# EAGLE design LedDriver (EAGLE 7.5.0)
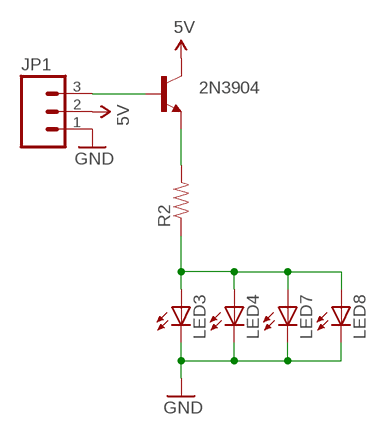
[diagram p0: schematic, sheet 1]

## Parts
2N3904  TRANSISTOR_NPNTO-92-AMMO  [TO-92-AMMO]
JP1  M03PTH  [1X03]
LED3  LED5MM  [LED5MM]
LED4  LED5MM  [LED5MM]
LED7  LED5MM  [LED5MM]
LED8  LED5MM  [LED5MM]
R2  RESISTORAXIAL-0.3  [AXIAL-0.3]

## Nets
5V: 2N3904.3(C) JP1.2
GND: JP1.1 LED3.K(C) LED4.K(C) LED7.K(C) LED8.K(C)
N$3: LED3.A LED4.A LED7.A LED8.A R2.P$1
N$7: 2N3904.1(E) R2.P$2
N$9: 2N3904.2(B) JP1.3

## Library data of the parts
2N3904 = barbary_enterprises:TRANSISTOR_NPN: Generic NPN BJT MMBT2222A - TRANS-08049 (SOT-23, 1A 40V) MPSA42 - TRANS-09116 (SOT-23, 500mA 300V) MMBT5088LT1G - TRANS-11160 (SOT-23, 50 mA 30V)
JP1 = SparkFun-Connectors:M03: Header 3 Standard 3-pin 0.1" header. Use with straight break away headers (SKU : PRT-00116), right angle break away headers (PRT-00553), swiss pins (PRT-00743), machine pins (PRT-00117), and female headers (PRT-00115). Molex polarized connector foot print use with SKU : PRT-08232 with associated crimp pins and housings.
LED3 LED4 LED7 LED8 = barbary_enterprises:LED: LEDs Standard schematic elements and footprints for 5mm, 3mm, 1206, and 0603 sized LEDs. 5mm - Spark Fun Electronics SKU : COM-00529 (and others)
R2 = barbary_enterprises:RESISTOR: Resistor Basic schematic elements and footprints for 0603, 1206, and PTH resistors.

## Board
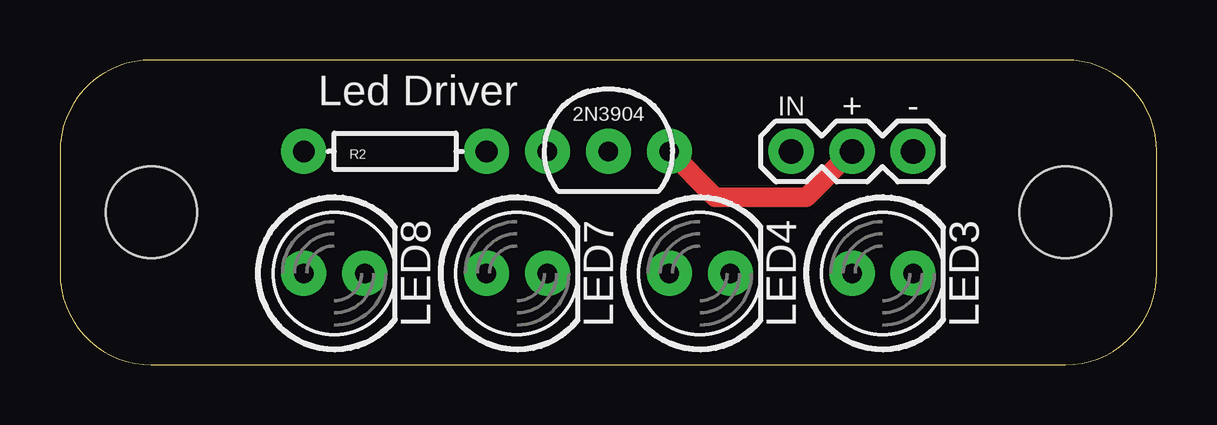
[diagram p1: board, top side]
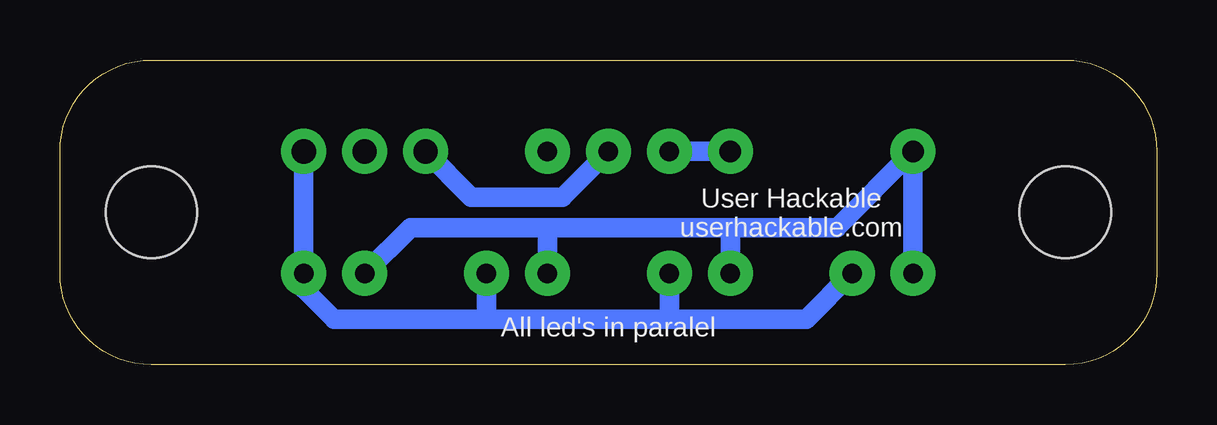
[diagram p2: board, bottom side, seen from below]

Size 45.72 x 12.7 mm. Coordinates in mm from the lower left corner, seen from the top.
Outline: 45.72,3.81 45.72,8.89 arc90 41.91,12.7 3.81,12.7 arc90 0,8.89 0,3.81 arc90 3.81,0 41.91,0 arc90 45.72,3.81
Copper layers (1*16): Top 0.035mm / dielectric 1.5mm / Bottom 0.035mm
Design rules "default": minimum track width 10mil, minimum drill 24mil, track to track 8mil, track to pad 8mil, pad to pad 8mil, via to via 8mil, smd to smd 8mil, copper to edge 40mil, drill to drill 8mil, minimum pad ring 10mil, minimum via ring 8mil, stop-mask expansion 4mil, vias tented up to drill 0mil, thermal gap 10mil
Holes 3.81 mm at 41.91,6.35 3.81,6.35

### Footprints (pad centres in the part's own frame; a part is rotated, then mirrored left to right if it is on the bottom)
TO-92-AMMO = drill 0.813 pad 1.88: 1 -2.54,0; 2 0,0; 3 2.54,0
1X03 = drill 1.016 pad 1.88: 1 0,0; 2 2.54,0; 3 5.08,0
LED5MM = drill 0.813 pad 1.88: A -1.27,0; K 1.27,0
AXIAL-0.3 = drill 0.9 pad 1.88: P$1 -3.81,0; P$2 3.81,0

### Placement (x,y rotation side)
2N3904  22.86,8.89 0 top
JP1  35.56,8.89 180 top
LED3  34.29,3.81 0 top
LED4  26.67,3.81 0 top
LED7  19.05,3.81 0 top
LED8  11.43,3.81 0 top
R2  13.97,8.89 0 top

### Tracks (layer width: path | path; a pad name or v marks a point on that pad's centre or on a via)
5V
  Top 0.813: JP1.2 31.11,6.99 27.3,6.99 2N3904.3
GND
  Bottom 0.813: 27.94,1.91 34.29,1.91 35.56,3.17 LED3.K JP1.1 | 27.94,1.91 20.32,1.91 | 20.32,1.91 14.61,1.91 LED8.K | LED7.K 20.32,1.91 | LED4.K 27.94,1.91
N$3
  Bottom 0.813: LED3.A 31.11,5.71 25.4,5.71 | 25.4,5.71 17.78,5.71 | 17.78,5.71 13.34,5.71 R2.P$1 LED8.A | LED7.A 17.78,5.71 | LED4.A 25.4,5.71
N$7
  Bottom 0.813: R2.P$2 2N3904.1
N$9
  Bottom 0.813: 2N3904.2 24.77,6.99 28.57,6.99 JP1.3

### Text on the board
tPlace: Led Driver | IN | + | -
bPlace: User Hackable / userhackable.com | All led's in paralel